# EAGLE design pm25_mainboard_v0.3 (EAGLE 9.6.2)
Assembly variants: DVT, EVT

## Sheet 1 of 3: MCU
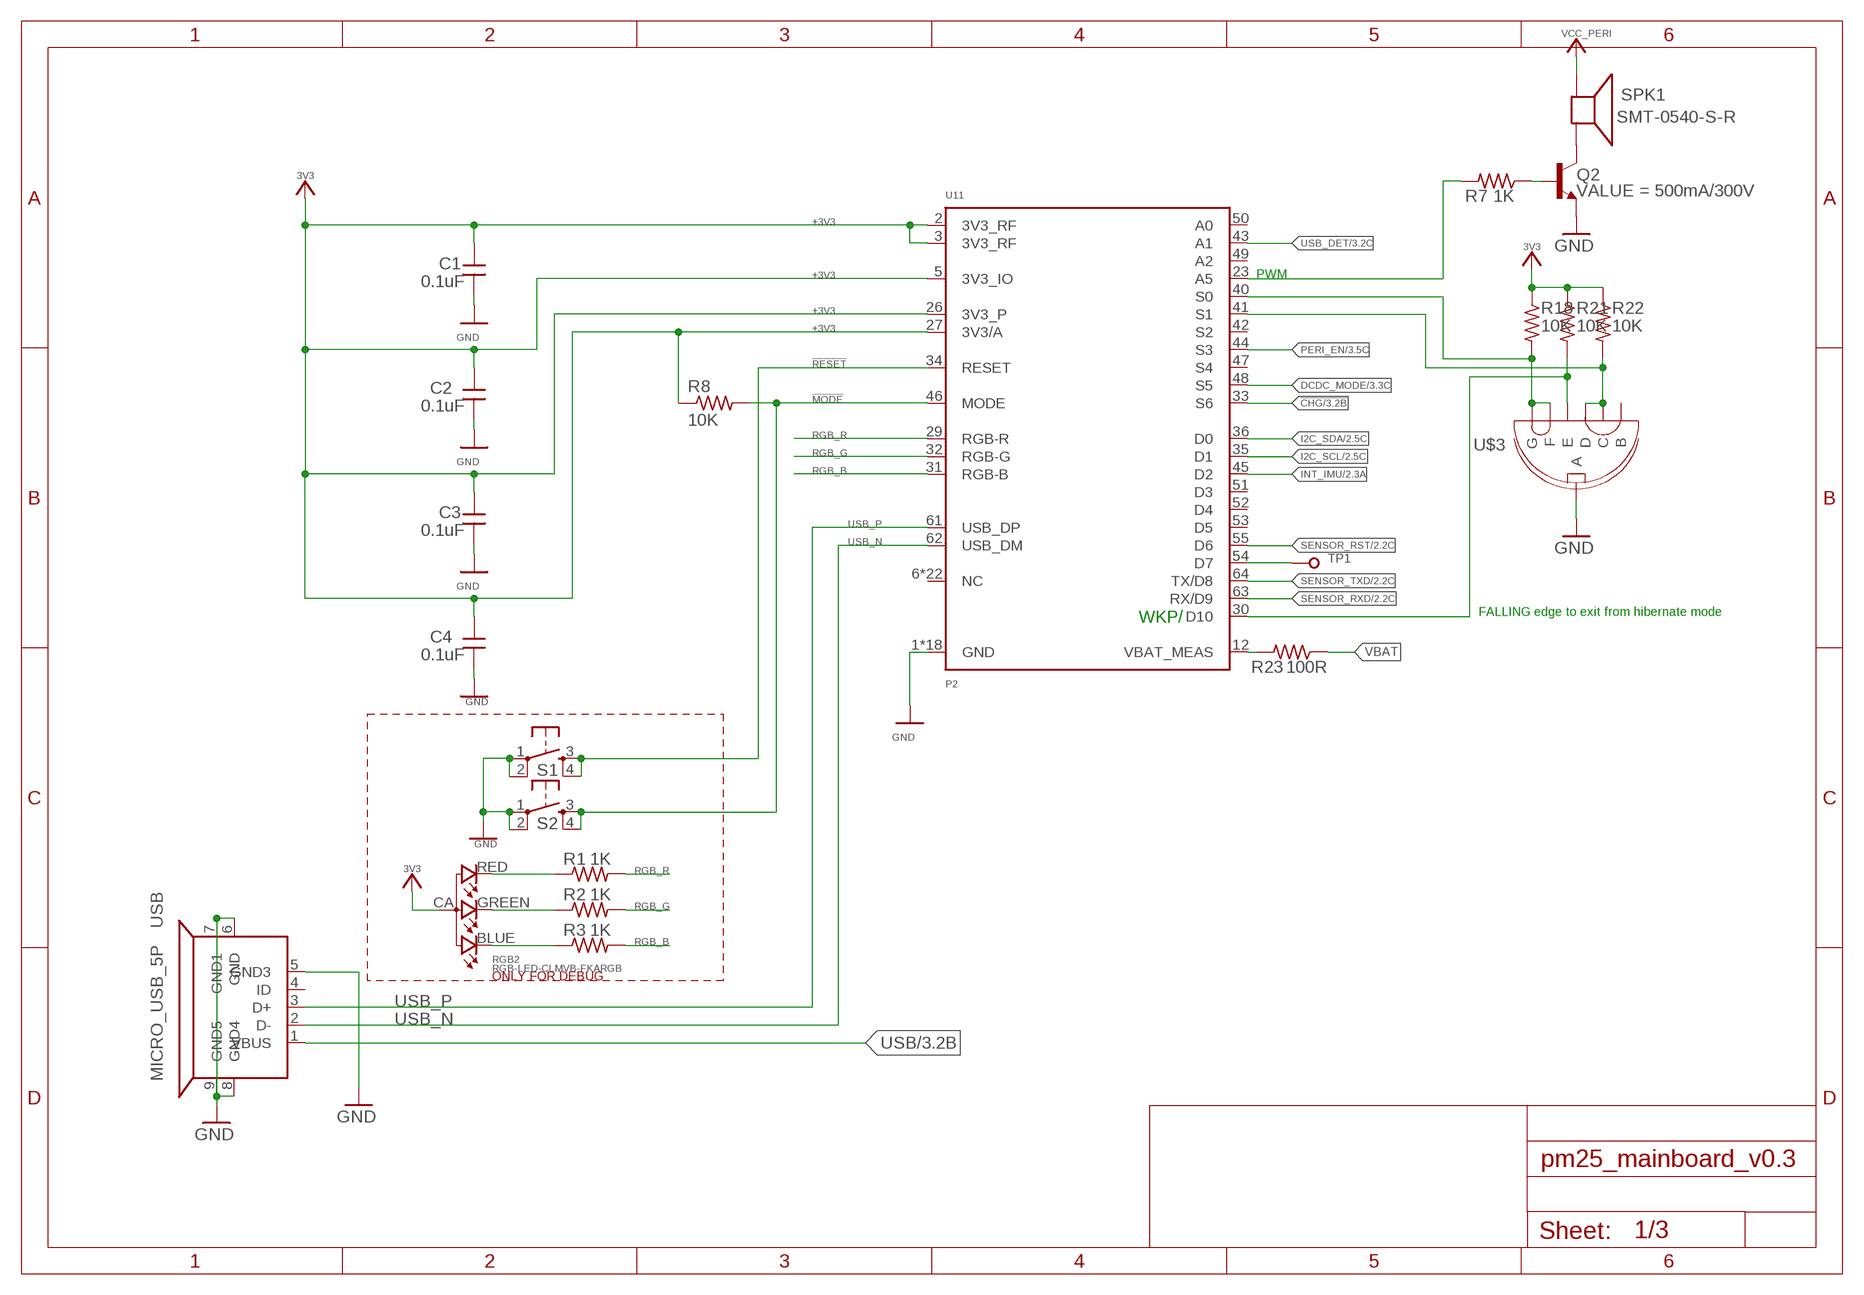
[diagram p0: schematic, sheet 1]

### Parts
C1  0.1uF  CAP_0603  [C0603_P]
C2  0.1uF  CAP_0603  [C0603_P]
C3  0.1uF  CAP_0603  [C0603_P]
C4  0.1uF  CAP_0603  [C0603_P]
Q2  500mA/300V  TRANS_NPN-MMBTA42  [SOT23-3]
R1  1K  RES_0603  [R0603_P]
R2  1K  RES_0603  [R0603_P]
R3  1K  RES_0603  [R0603_P]
R7  1K  RES_1K_0603  [R0603_P]
R8  10K  RES_0603  [R0603_P]
R18  10K  RES_1K_0603  [R0603_P]
R21  10K  RES_1K_0603  [R0603_P]
R22  10K  RES_1K_0603  [R0603_P]
R23  100R  RES_1K_0603  [R0603_P]
RGB2  RGB-LED-CLMVB-FKARGB  [PLCC4-2MM-RGB]
S1  TAC_SWITCHSMD  [TACTILE_SWITCH_SMD]
S2  TAC_SWITCHSMD  [TACTILE_SWITCH_SMD]
SPK1  SMT-0540-S-R  [SMT-0540-S-R]
TP1  TP-1.5MM  [TP]
U11  P2  [P2]
U$3  MULTI_FUN_SWITCH  [MULTI_FUN_SWITCH]
USB  MICRO_USB_5P  MICRO_USBMICRO_USB  [MICRO_USB]

### Nets
!CHG: U11.33(S6) ; also sheet 3
!MODE: R8.2 S2.3 S2.4 U11.46(MODE)
!RESET: S1.3 S1.4 U11.34(RESET)
+3V3: C1.1 C2.1 C3.1 C4.1 R8.1 R18.1 R21.1 R22.1 RGB2.CA U11.2(3V3_RF) U11.3(3V3_RF) U11.5(3V3_IO) U11.26(3V3_P) U11.27(3V3/A) ; supply symbol labelled 3V3 ; also sheet 3
BUZZER: R7.2 U11.23(A5)
DCDC_MODE: U11.48(S5) ; also sheet 3
GND: C1.2 C2.2 C3.2 C4.2 Q2.2(E) S1.1 S1.2 S2.1 S2.2 U11.1(GND) U11.4(GND) U11.13(GND) U11.15(GND) U11.25(GND) U11.28(GND) U11.37(GND) U11.39(GND) U11.59(GND) U11.65(GND) U11.66(GND) U11.67(GND) U11.68(GND) U11.69(GND) U11.70(GND) U11.71(GND) U11.72(GND) U11.73(GND) U$3.A USB.5(GND3) USB.6(GND) USB.7(GND1) USB.8(GND4) USB.9(GND5) ; also sheet 2,3
I2C_SCL: U11.35(D1) ; also sheet 2
I2C_SDA: U11.36(D0) ; also sheet 2
INT_IMU: U11.45(D2) ; also sheet 2
LEFT: R22.2 U11.41(S1) U$3.C U$3.D
MID: R21.2 U11.30(D10) U$3.E
N$9: Q2.3(C) SPK1.-(+)
N$11: R23.2 U11.12(VBAT_MEAS)
N$12: TP1.TP U11.54(D7)
N$17: R1.1 RGB2.RED
N$18: R2.1 RGB2.GREEN
N$19: R3.1 RGB2.BLUE
N$21: Q2.1(B) R7.1
PERI_EN: U11.44(S3) ; also sheet 3
RGB_B: R3.2 U11.31(RGB-B)
RGB_G: R2.2 U11.32(RGB-G)
RGB_R: R1.2 U11.29(RGB-R)
RIGHT: R18.2 U11.40(S0) U$3.F U$3.G
SENSOR_RST: U11.55(D6) ; also sheet 2
SENSOR_RXD: U11.63(RX/D9) ; also sheet 2
SENSOR_TXD: U11.64(TX/D8) ; also sheet 2
USB: USB.1(VBUS) ; also sheet 3
USB_DET: U11.43(A1) ; also sheet 3
USB_N [diff pair]: U11.62(USB_DM) USB.2(D-)
USB_P [diff pair]: U11.61(USB_DP) USB.3(D+)
VBAT: R23.1 ; also sheet 3
VCC_PERI: SPK1.+(-) ; also sheet 2,3
Unconnected: U11.6(NC) U11.7(NC) U11.8(NC) U11.9(NC) U11.10(NC) U11.11(NC) U11.14(NC) U11.16(NC) U11.17(NC) U11.18(NC) U11.19(NC) U11.20(NC) U11.21(NC) U11.22(NC) U11.24(NC) U11.38(NC) U11.42(S2) U11.47(S4) U11.49(A2) U11.50(A0) U11.51(D3) U11.52(D4) U11.53(D5) U11.56(NC) U11.57(NC) U11.58(NC) U11.60(NC) U11.74(NC) U11.75(NC) U$3.B USB.4(ID)

### Notes on the sheet
- PWM
- FALLING edge to exit from hibernate mode
- WKP/
- ONLY FOR DEBUG

## Sheet 2 of 3: SENSORS
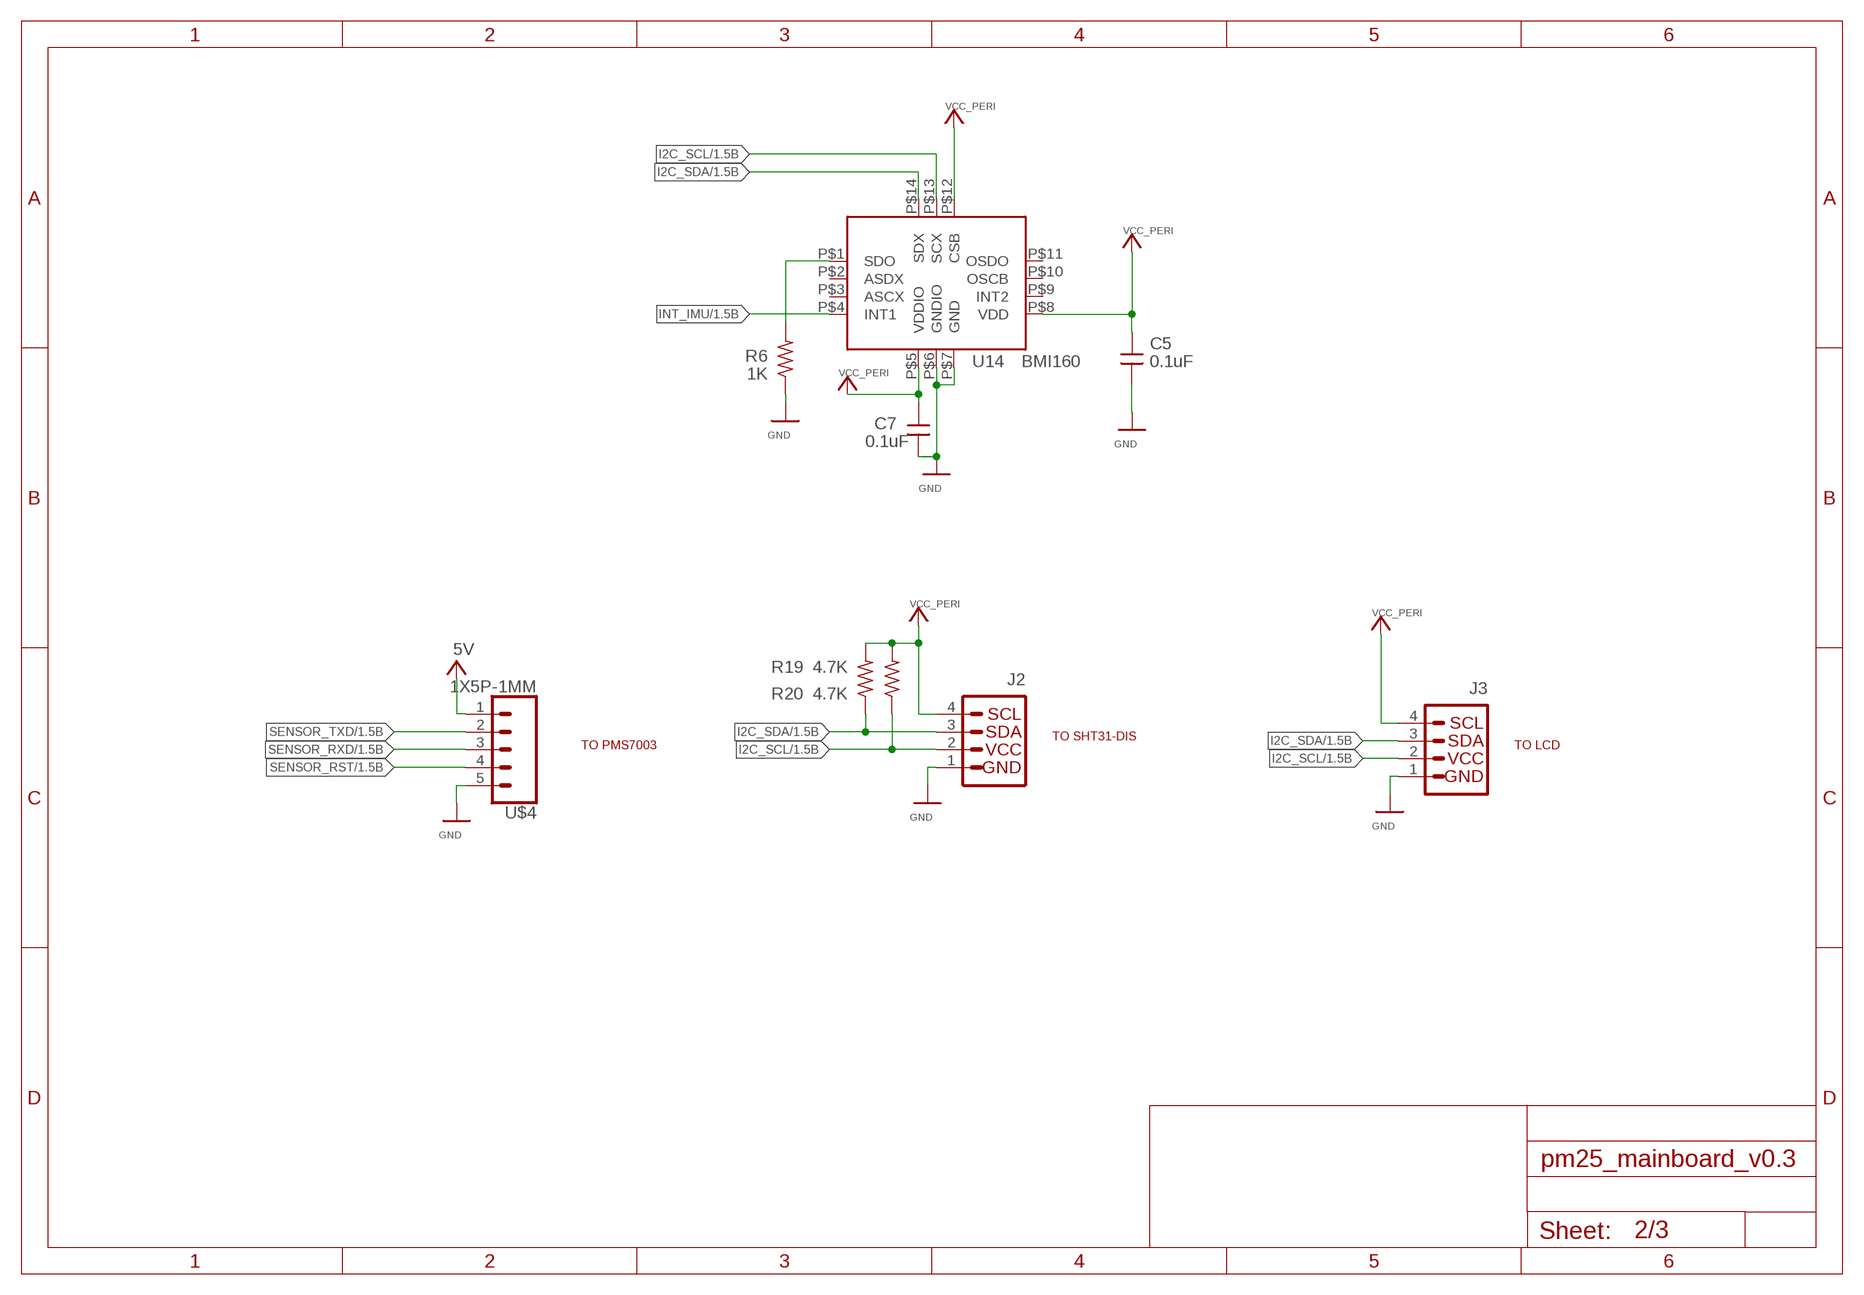
[diagram p1: schematic, sheet 2]

### Parts
C5  0.1uF  CAP_0603  [C0603_P]
C7  0.1uF  CAP_0603  [C0603_P]
J2  QWIIC_CONNECTORJS-1MM  [1X04_1MM_RA]
J3  QWIIC_CONNECTORJS-1MM  [1X04_1MM_RA]
R6  1K  RES_0603  [R0603_P]
R19  4.7K  RES_0603  [R0603_P]
R20  4.7K  RES_0603  [R0603_P]
U14  BMI160  BMI160  [LGA-14L]
U$4  1X5P-1MM  [1X05-1MM]

### Nets
5V: U$4.1 ; also sheet 3
GND: C5.2 C7.2 J2.1(GND) J3.1(GND) R6.1 U14.P$6(GNDIO) U14.P$7(GND) U$4.5 ; also sheet 1,3
I2C_SCL: J2.2(VCC) J3.2(VCC) R20.1 U14.P$13(SCX) ; also sheet 1
I2C_SDA: J2.3(SDA) J3.3(SDA) R19.1 U14.P$14(SDX) ; also sheet 1
INT_IMU: U14.P$4(INT1) ; also sheet 1
N$1: R6.2 U14.P$1(SDO)
SENSOR_RST: U$4.4 ; also sheet 1
SENSOR_RXD: U$4.3 ; also sheet 1
SENSOR_TXD: U$4.2 ; also sheet 1
VCC_PERI: C5.1 C7.1 J2.4(SCL) J3.4(SCL) R19.2 R20.2 U14.P$5(VDDIO) U14.P$8(VDD) U14.P$12(CSB) ; also sheet 1,3
Unconnected: U14.P$2(ASDX) U14.P$3(ASCX) U14.P$9(INT2) U14.P$10(OSCB) U14.P$11(OSDO)

### Notes on the sheet
- TO SHT31-DIS
- TO PMS7003 | TO LCD

## Sheet 3 of 3: POEWR
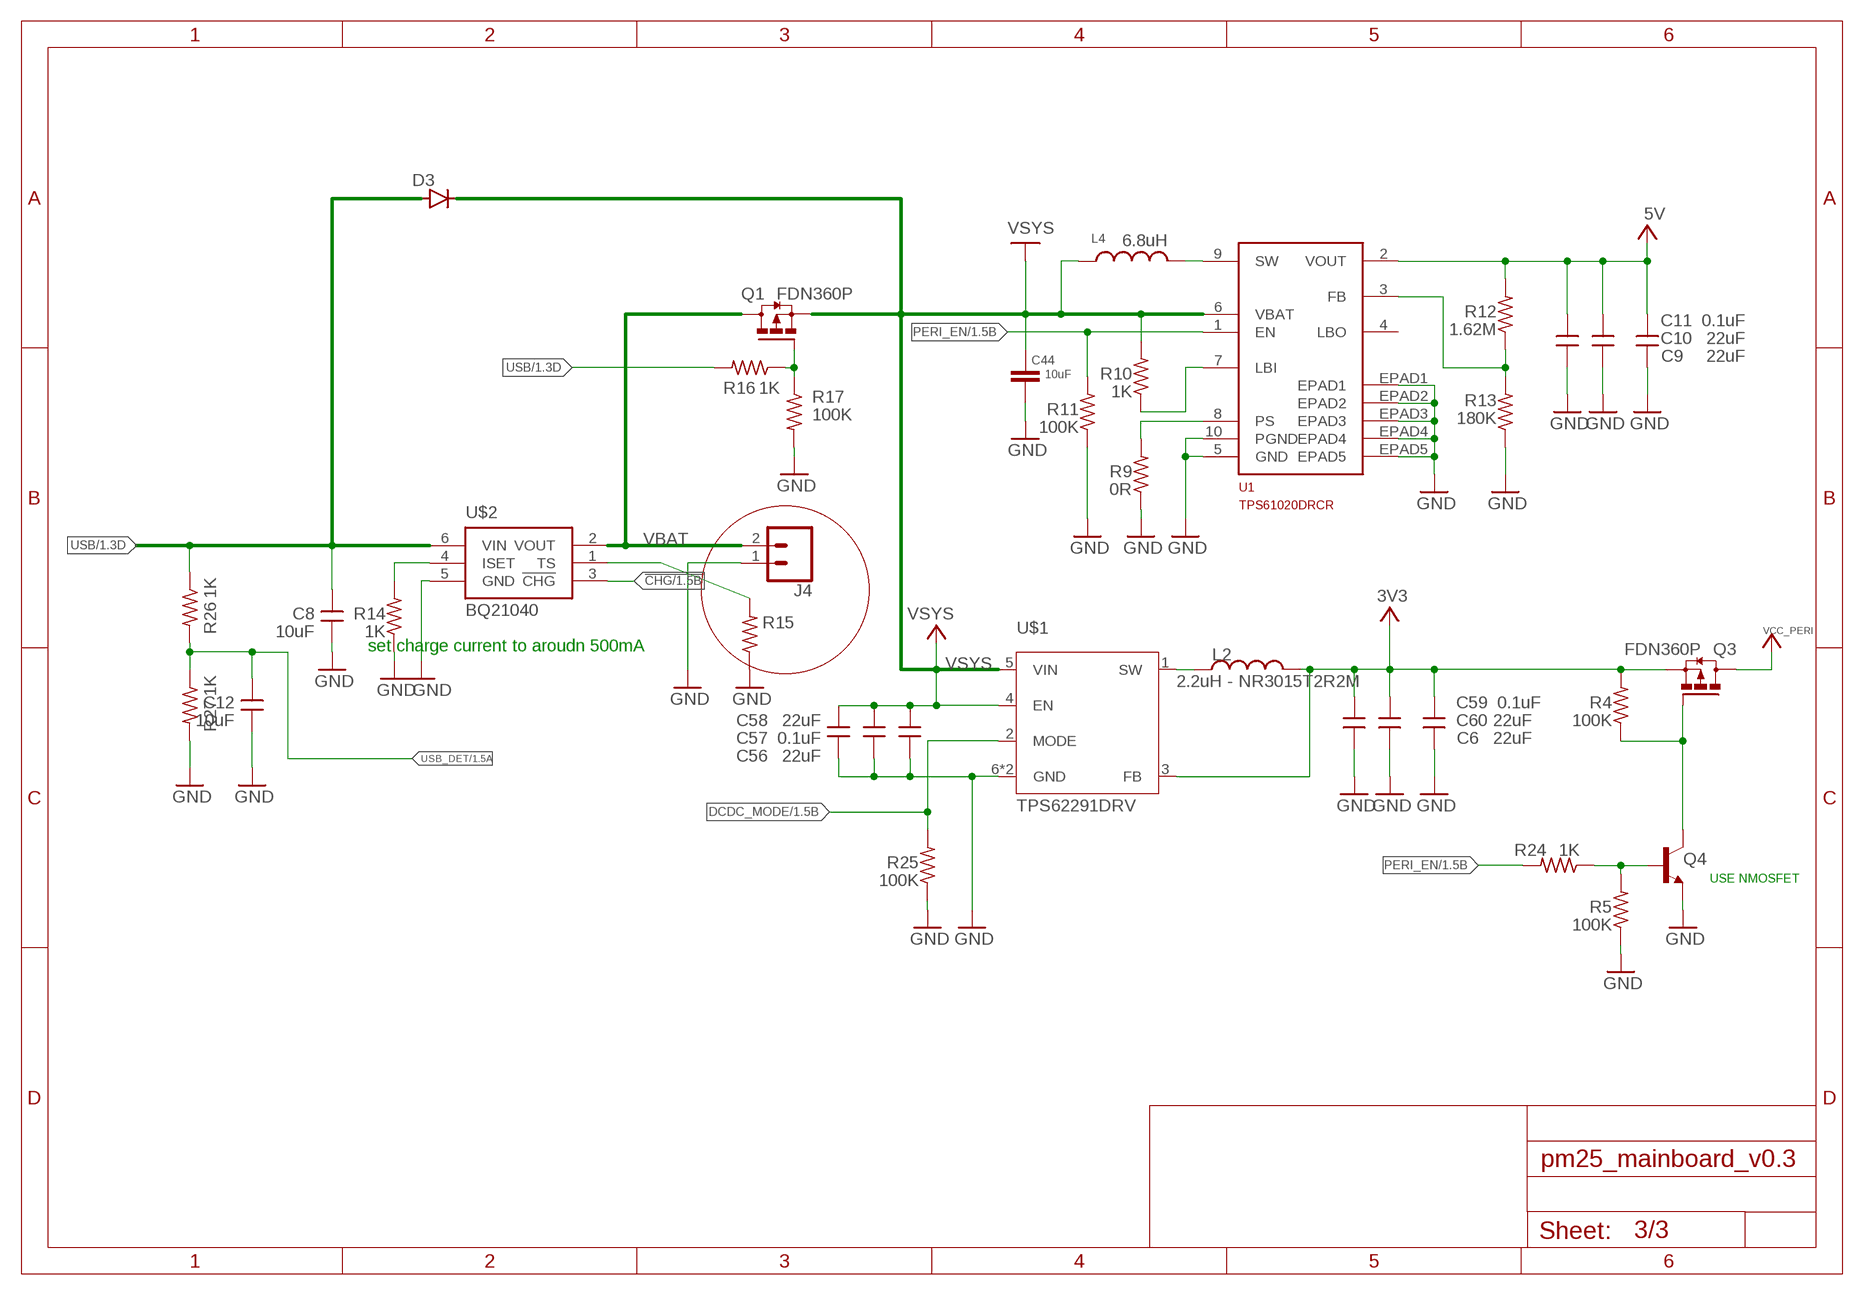
[diagram p2: schematic, sheet 3]

### Parts
C6  22uF  CAP_0603  [C0603_P]
C8  10uF  CAP_0603  [C0603_P]
C9  0.1uF  CAP_0603  [C0603_P]
C10  22uF  CAP_0603  [C0603_P]
C11  22uF  CAP_0603  [C0603_P]
C12  10uF  CAP_0603  [C0603_P]
C44  10uF  GRM21BR61C106KE15K  [C0805_MURATA_GRM21]
C56  22uF  CAP_0603  [C0603_P]
C57  0.1uF  CAP_0603  [C0603_P]
C58  22uF  CAP_0603  [C0603_P]
C59  0.1uF  CAP_0603  [C0603_P]
C60  22uF  CAP_0603  [C0603_P]
D3  DIODE-SOD123  [SOD123]
J4  CONN_02-JST-2MM-SMT  [JST-2-SMD]
L2  2.2uH - NR3015T2R2M  INDUCTOR-SPARKFUNNR3015T4R7M  [INDUCTOR-NR3015]
L4  6.8uH  CDRH5D28NP-6R2NC  [CDRH5D28NP-6R2NC]
Q1  FDN360P  [SUPER-SOT3]
Q3  FDN360P  [SUPER-SOT3]
Q4  TRANS_NPN-MMBTA42  [SOT23-3]
R4  100K  RES_0603  [R0603_P]
R5  100K  RES_0603  [R0603_P]
R9  0R  RES_0603  [R0603_P]
R10  1K  RES_0603  [R0603_P]
R11  100K  RES_0603  [R0603_P]
R12  1.62M  RES_0603  [R0603_P]
R13  180K  RES_0603  [R0603_P]
R14  1K  RES_0603  [R0603_P]
R15  RES_0603  [R0603_P]
R16  1K  RES_0603  [R0603_P]
R17  100K  RES_0603  [R0603_P]
R24  1K  RES_0603  [R0603_P]
R25  100K  RES_0603  [R0603_P]
R26  1K  RES_0603  [R0603_P]
R27  1K  RES_0603  [R0603_P]
U1  TPS61020DRCR  [TPS61020DRCR]
U$1  TPS62291DRV  [S-PWSON-N6]
U$2  BQ21040  [SOT23-6]

### Nets
3V8_SW: L4.P$2 U1.9(SW)
5V: C9.2 C10.2 C11.2 R12.2 U1.2(VOUT) ; also sheet 2
!CHG: U$2.3(!CHG) ; also sheet 1
+3V3: C6.2 C59.2 C60.2 L2.2 Q3.2(S) R4.2 U$1.3(FB) ; supply symbol labelled 3V3 ; also sheet 1
DCDC_MODE: R25.2 U$1.2(MODE) ; also sheet 1
GND: C6.1 C8.1 C9.1 C10.1 C11.1 C12.1 C44.2 C56.1 C57.1 C58.1 C59.1 C60.1 J4.1 Q4.2(E) R5.1 R9.1 R11.1 R13.1 R14.1 R15.1 R17.2 R25.1 R27.2 U1.5(GND) U1.10(PGND) U1.EPAD1 U1.EPAD2 U1.EPAD3 U1.EPAD4 U1.EPAD5 U$1.6(GND) U$1.TP(GND) U$2.5(GND) ; also sheet 1,2
N$2: R9.2 U1.8(PS)
N$3: R10.1 U1.7(LBI)
N$4: R14.2 U$2.4(ISET)
N$5: R12.1 R13.2 U1.3(FB)
N$6: Q3.1(G) Q4.3(C) R4.1
N$7: R15.2 U$2.1(TS)
N$8: Q1.1(G) R16.1 R17.1
N$10: Q4.1(B) R5.2 R24.1
N$52: L2.1 U$1.1(SW)
PERI_EN: R11.2 R24.2 U1.1(EN) ; also sheet 1
USB: C8.2 D3.A R16.2 R26.1 U$2.6(VIN) ; also sheet 1
USB_DET: C12.2 R26.2 R27.1 ; also sheet 1
VBAT: J4.2 Q1.3(D) U$2.2(VOUT) ; also sheet 1
VCC_PERI: Q3.3(D) ; also sheet 1,2
VSYS: C44.1 C56.2 C57.2 C58.2 D3.C L4.P$1 Q1.2(S) R10.2 U1.6(VBAT) U$1.4(EN) U$1.5(VIN)
Unconnected: U1.4(LBO)

### Notes on the sheet
- set charge current to aroudn 500mA
- USE NMOSFET

## Library data of the parts
C1-C12 C56-C60 = particle-studios:CAP_
C44 = CAPACITOR:GRM21BR61C106KE15K; PACKAGE: 0805; RATING: 16V; TOLERANCE: 10%
D3 = diode:DIODE-: DIODE
J2 J3 = SparkFun-Connectors:QWIIC_CONNECTOR: SparkFun I2C Standard Qwiic Connector An SMD 1mm pitch JST connector makes it easy and quick (get it? Qwiic?) to connect I2C devices to each other. The Qwiic system <http://www.sparkfun.com/qwiic> enables fast and solderless connection between popular platforms and various sensors and actuators. We carry 200mm <https://www.sparkfun.com/products/14204>, 100mm <https://www.sparkfun.com/products/14205>, 50mm <https://www.sparkfun.com/products/14206>, and breadboard friendly <https://www.sparkfun.com/products/14207> Qwiic cables. We also offer 10 pcs strips <https://www.sparkfun.com/products/14323> the SMD connectors.
J4 = SparkFun-Connectors:CONN_02: Multi connection point. Often used as Generic Header-pin footprint for 0.1 inch spaced/style header connections On any of the 0.1 inch spaced packages, you can populate with these: Break Away Headers - Straight <https://www.sparkfun.com/products/116> (PRT-00116) Break Away Male Headers - Right Angle <https://www.sparkfun.com/products/553> (PRT-00553) Female Headers <https://www.sparkfun.com/products/115> (PRT-00115) Break Away Headers - Machine Pin <https://www.sparkfun.com/products/117> (PRT-00117) Break Away Female Headers - Swiss Machine Pin <https://www.sparkfun.com/products/743> (PRT-00743) For SCREWTERMINALS and SPRING TERMINALS visit here: Screw Terimnals on SparkFun.com <https://www.sparkfun.com/search/results?term=Screw+Terminals> (5mm/3.5mm/2.54mm spacing) This device is also useful as a general connection point to wire up your design to another part of your project. Our various solder wires solder well into these plated through hole pads. Hook-Up Wire - Assortment (Stranded, 22 AWG) <https://www.sparkfun.com/products/11375> (PRT-11375) Hook-Up Wire - Assortment (Solid Core, 22 AWG) <https://www.sparkfun.com/products/11367> (PRT-11367) View the entire wire category on our website here <https://www.sparkfun.com/categories/141> Special notes: Molex polarized connector foot print use with: PRT-08233 with associated crimp pins and housings. 2.54_SCREWTERM for use with PRT-10571. 3.5mm Screw Terminal footprints for PRT-08084 5mm Screw Terminal footprints for use with PRT-08432; PROD_ID: CONN-11443
L2 = Particle:INDUCTOR-SPARKFUN: Inductors Basic Inductor/Choke - 0603 and 1206. Footprints are not proven and vary greatly between part numbers. SRN6045- 33uH, 20% 1.4A; DESP: FIXED IND 2.2UH 1.5A 72 MOHM SMD; MFG: TAIYO; MPN: NR3015T2R2M; NR3015T4R7M: 4.7uH; PPN: PT-200013
L4 = Particle_AT_Power:CDRH5D28NP-6R2NC; PACKAGE: 5757; RATING: 1.8A; TOLERANCE: 30%; VALUE: 6.2µH
Q1 Q3 = transistor-power:FDN360P: Single P-Channel, PowerTrench (R) MOSFET Source: http://www.fairchildsemi.com/ds/FD/FDN360P.pdf
Q2 = SparkFun-DiscreteSemi:TRANS_NPN: NPN transistor Current controlled devices typically used to amplify current or used as a switch. BC547 - COM-08928 <http://www.sparkfun.com/products/8928> (TO-92 45V 100mA) (1.Collector 2.Base 3.Emitter) 2N3904 - COM-00521 <http://www.sparkfun.com/products/521> (TO-92 40V 200mA) (1.Emitter 2.Base 3.Collector) P2N2222A - COM-12852 <http://www.sparkfun.com/products/12852> (TO-92 40V 600mA) (1.Collector 2.Base 3.Emitter); DESP: TRANS NPN 300V 0.5A SOT23-3; MFG: DIODES INC; MPN: MMBTA42-7-F; PPN: PT-200313; PROD_ID: TRANS-09116
Q4 = SparkFun-DiscreteSemi:TRANS_NPN: NPN transistor Current controlled devices typically used to amplify current or used as a switch. BC547 - COM-08928 <http://www.sparkfun.com/products/8928> (TO-92 45V 100mA) (1.Collector 2.Base 3.Emitter) 2N3904 - COM-00521 <http://www.sparkfun.com/products/521> (TO-92 40V 200mA) (1.Emitter 2.Base 3.Collector) P2N2222A - COM-12852 <http://www.sparkfun.com/products/12852> (TO-92 40V 600mA) (1.Collector 2.Base 3.Emitter); DESP: TRANS NPN 300V 0.5A SOT23-3; MFG: DIODES INC; MPN: MMBTA42-7-F; PPN: PT-200313; PROD_ID: TRANS-09116; VALUE: 500mA/300V
R1-R6 R8-R17 R19 R20 R24-R27 = particle-studios:RES_: Particle Resistors
R7 = particle-studios:RES_: Particle Resistors; DESP: RES SMD 1K OHM 1% 1/16W 0603; MFG: FENGHUA; MPN: RC-03K102FT; PPN: PT-200135
R18 R21-R23 = particle-studios:RES_: Particle Resistors; DESP: RES SMD 1K OHM 1% 1/16W 0603; MFG: FENGHUA; MPN: RC-03K102FT; PPN: PT-200135; VALUE: 1K
RGB2 = Particle:RGB-LED-CLMVB-FKA: CREE CLMVB-FKA RGB LED 2mm x 2mm
S1 S2 = Particle:TAC_SWITCH: SMD Tactiile Switch
SPK1 = adafruit:SMT-0540-S-R: SMT-0549-S-R Small surface-mount magnetic buzzer; DESP: AUDIO MAGNETIC XDCR 2-4V SMD; MFG: PUI Audio; MPN: SMT-0540-S-R; PPN: 190-00001
TP1 = particle-studios:TP
U1 = particle-studios:TPS61020DRCR
U11 = particle-studios:P2: Particle P2
U14 = particle SZ:BMI160
U$1 = particle-studios:TPS62291
U$2 = particle-studios:BQ21040
U$3 = particle-studios:MULTI_FUN_SWITCH
U$4 = particle-studios:1X5P-1MM
USB = RedBear:MICRO_USB: Micro-USB

## Net classes
0 default: clearance 0.152 mm
1 diff pair: width 0.152 mm, drill 0.3 mm, clearance 0.152 mm
2 120R_Impedance: width 0.152 mm
3 BAT: clearance 0.203 mm
6 +3V3: clearance 0.152 mm

## Board
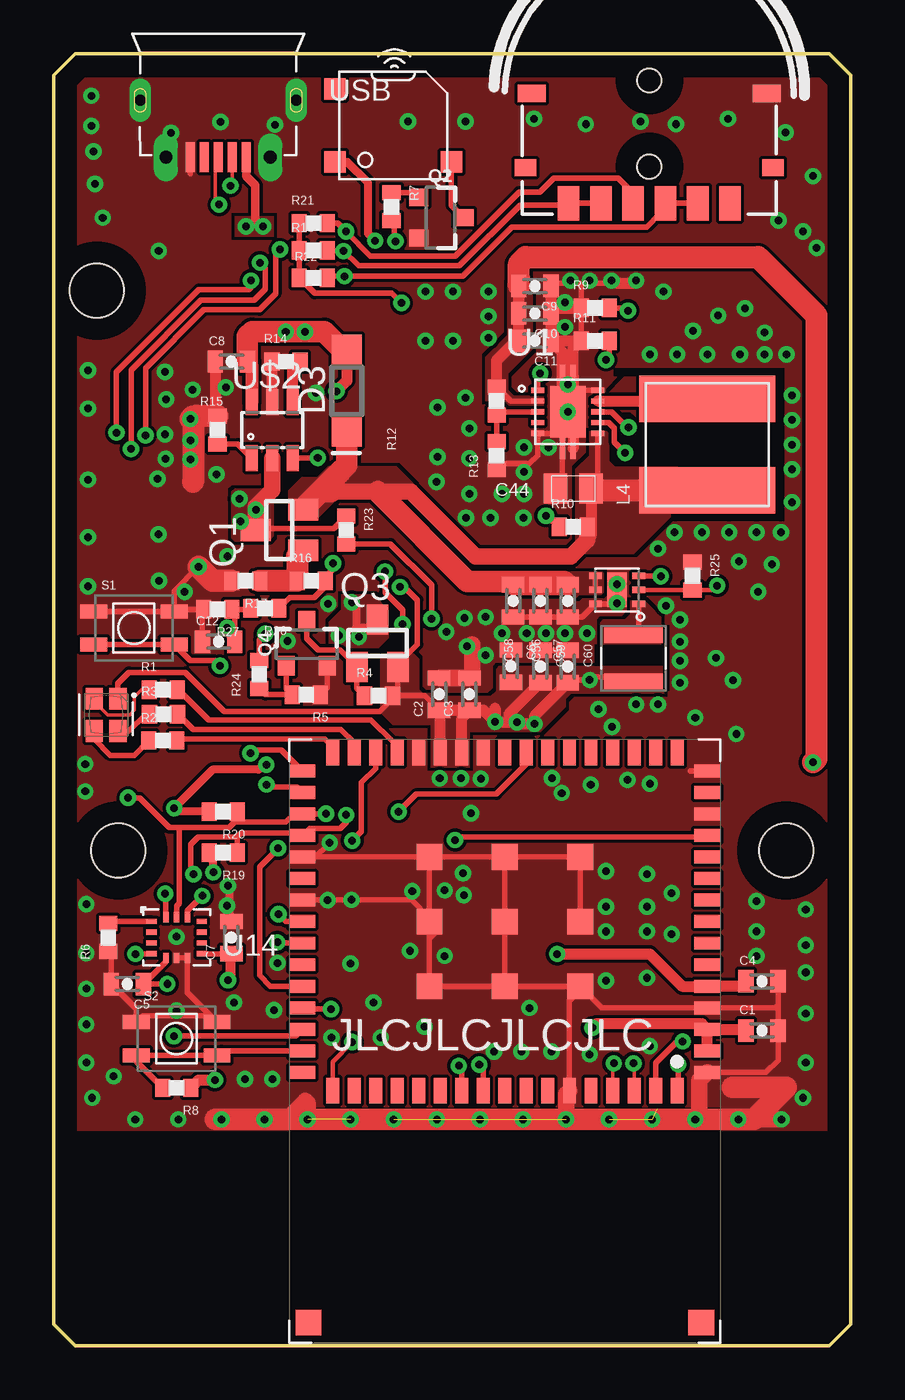
[diagram p3: board, top side]
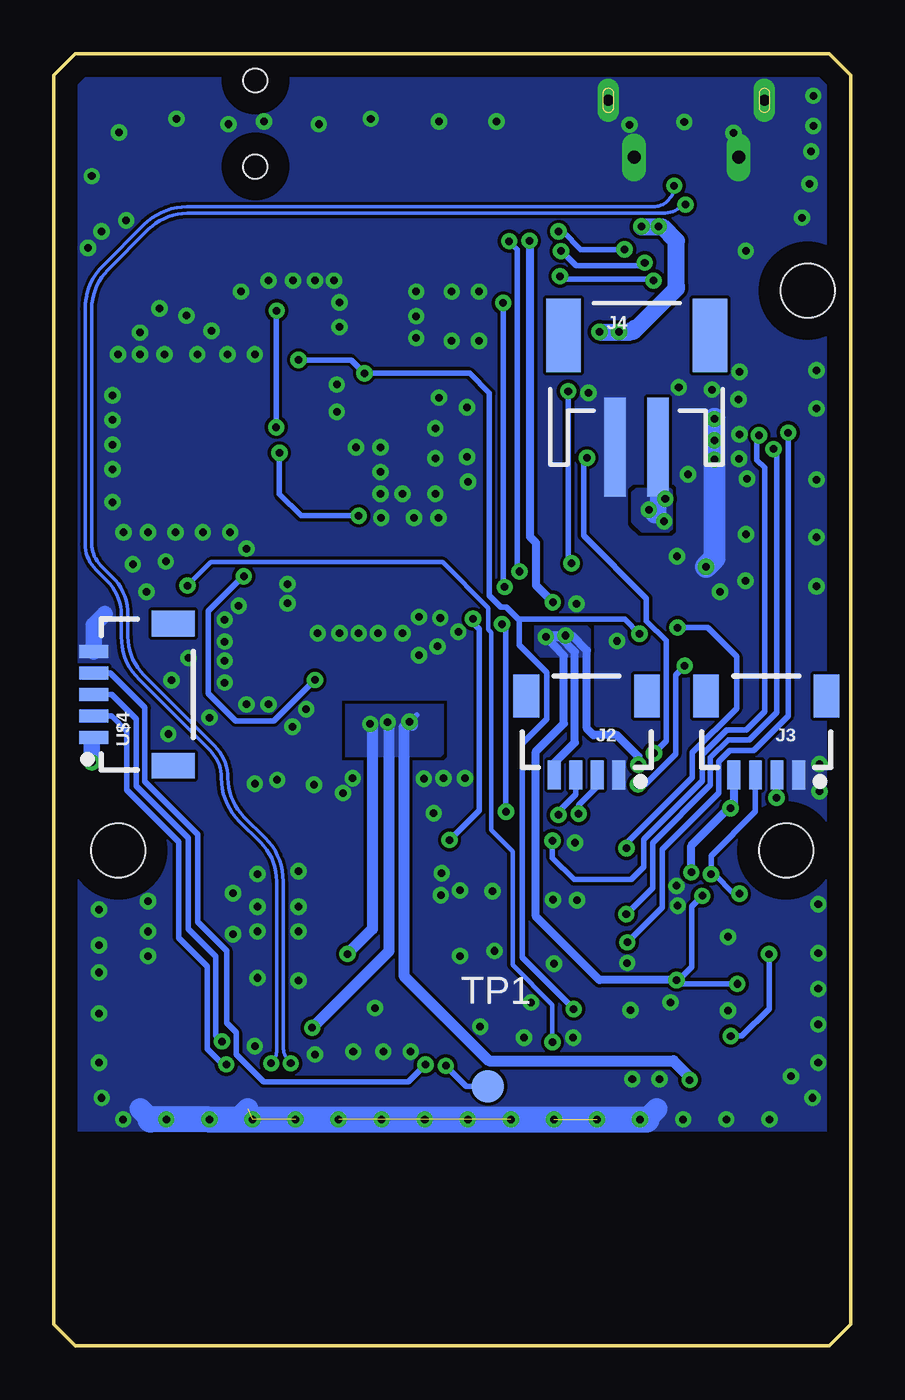
[diagram p4: board, bottom side, seen from below]

Size 37 x 60 mm. Coordinates in mm from the lower left corner, seen from the top.
Outline: 0,59 1,60 36,60 37,59 37,1 36,0 1,0 0,1 0,59
Copper layers (1*16): Top 0.035mm / dielectric 1.5mm / Bottom 0.035mm
Design rules "default *": minimum track width 6mil, minimum drill 0.35mm, track to track 6mil, track to pad 6mil, pad to pad 6mil, via to via 6mil, smd to smd 6mil, copper to edge 40mil, drill to drill 6mil, minimum pad ring 10mil, minimum via ring 8mil, stop-mask expansion 4mil, vias tented up to drill 3.6mm, thermal gap 10mil
Holes 2.5 mm at 3,23 34,23 2,49

### Footprints (pad centres in the part's own frame; a part is rotated, then mirrored left to right if it is on the bottom)
C0603_P = smd 0.711 x 1.041: 1 -0.749,0; 2 0.749,0
C0805_MURATA_GRM21 = smd 1.1 x 1.4: 1 -0.825,0; 2 0.825,0
SOD123 = smd 1.4 x 1.4: A 1.9,0; C -1.9,0
1X04_1MM_RA = smd 0.6 x 1.35: 1 -1.5,0; 2 -0.5,0; 3 0.5,0; 4 1.5,0 | smd 1.2 x 2: NC1 2.8,-3.675; NC2 -2.8,-3.675
JST-2-SMD = smd 1 x 4.6: 1 -1,-3.7; 2 1,-3.7 | smd 1.6 x 3.4: NC1 -3.4,1.5; NC2 3.4,1.5
INDUCTOR-NR3015 = smd 0.8 x 2.7: 1 -1.1,0; 2 1.1,0
CDRH5D28NP-6R2NC = smd 2.15 x 6.3: P$1 -2.125,0; P$2 2.125,0
SUPER-SOT3 = smd 1 x 1.4: 1 -0.95,-1.1; 2 0.95,-1.1; 3 0,1.1
SOT23-3 = smd 0.8 x 0.9: 1 -0.95,-1; 2 0.95,-1; 3 0,1.1
R0603_P = smd 0.7 x 0.85: 1 -0.65,0; 2 0.65,0
PLCC4-2MM-RGB = smd 1 x 0.8: BLUE -0.75,-0.55; CA 0.75,-0.55; GREEN -0.75,0.55; RED 0.75,0.55
TACTILE_SWITCH_SMD = smd 1.25 x 0.65: 1 -1.875,0.775; 2 1.875,0.775; 3 -1.875,-0.775; 4 1.875,-0.775
SMT-0540-S-R = smd 1 x 1: + 1.7,-2.7; - 1.7,2.7; M -1.7,-2.7
TP = smd 1.5 x 1.5: TP 0,0
TPS61020DRCR = smd 0.6 x 0.24: 1 -1.4,1; 2 -1.4,0.5; 3 -1.4,0; 4 -1.4,-0.5; 5 -1.4,-1; 6 1.4,-1; 7 1.4,-0.5; 8 1.4,0; 9 1.4,0.5; 10 1.4,1 | smd 1.65 x 2.4: EPAD1 0,0 | smd 0.25 x 1: EPAD2 -0.25,-1.7; EPAD3 0.25,-1.7; EPAD4 -0.25,1.7; EPAD5 0.25,1.7
P2 = smd 1.2 x 0.6: 1 -9.4,2.45; 2 -9.4,1.45; 3 -9.4,0.45; 4 -9.4,-0.55; 5 -9.4,-1.55; 6 -9.4,-2.55; 7 -9.4,-3.55; 8 -9.4,-4.55; 9 -9.4,-5.55; 10 -9.4,-6.55; 11 -9.4,-7.55; 12 -9.4,-8.55; 13 -9.4,-9.55; 14 -9.4,-10.55; 15 -9.4,-11.55; 33 9.4,-11.55; 34 9.4,-10.55; 35 9.4,-9.55; 36 9.4,-8.55; 37 9.4,-7.55; 38 9.4,-6.55; 39 9.4,-5.55; 40 9.4,-4.55; 41 9.4,-3.55; 42 9.4,-2.55; 43 9.4,-1.55; 44 9.4,-0.55; 45 9.4,0.45; 46 9.4,1.45; 47 9.4,2.45 | smd 0.6 x 1.2: 16 -8,-12.4; 17 -7,-12.4; 18 -6,-12.4; 19 -5,-12.4; 20 -4,-12.4; 21 -3,-12.4; 22 -2,-12.4; 23 -1,-12.4; 24 0,-12.4; 25 1,-12.4; 26 2,-12.4; 27 3,-12.4; 28 4,-12.4; 29 5,-12.4; 30 6,-12.4; 31 7,-12.4; 32 8,-12.4; 48 8,3.3; 49 7,3.3; 50 6,3.3; 51 5,3.3; 52 4,3.3; 53 3,3.3; 54 2,3.3; 55 1,3.3; 56 0,3.3; 57 -1,3.3; 58 -2,3.3; 59 -3,3.3; 60 -4,3.3; 61 -5,3.3; 62 -6,3.3; 63 -7,3.3; 64 -8,3.3 | smd 1.2 x 1.2: 65 -3.5,-1.55; 66 -3.5,-4.55; 67 -3.5,-7.55; 68 0,-1.55; 69 0,-4.55; 70 0,-7.55; 71 3.5,-1.55; 72 3.5,-4.55; 73 3.5,-7.55; 74 9.12,14.07; 75 -9.12,14.07
LGA-14L = smd 0.475 x 0.25: P$1 -1.165,0.75; P$2 -1.165,0.25; P$3 -1.165,-0.25; P$4 -1.165,-0.75; P$8 1.165,-0.75; P$9 1.165,-0.25; P$10 1.165,0.25; P$11 1.165,0.75 | smd 0.25 x 0.475: P$5 -0.5,-0.95; P$6 0,-0.95; P$7 0.5,-0.95; P$12 0.5,0.95; P$13 0,0.95; P$14 -0.5,0.95
S-PWSON-N6 = smd 0.3 x 0.6: 1 -0.65,-1; 2 0,-1; 3 0.65,-1; 4 0.65,1; 5 0,1; 6 -0.65,1 | smd 1.6 x 0.9: TP 0,0
SOT23-6 = smd 0.55 x 1.2: 1 -0.95,-1.3; 2 0,-1.3; 3 0.95,-1.3; 4 0.95,1.3; 5 0,1.3; 6 -0.95,1.3
MULTI_FUN_SWITCH = smd 1.3 x 0.8: A 5.45,5.1; S@3 -5.45,5.1 | smd 1 x 1.6: B 3.75,0; C 2.25,0; D 0.75,0; E -0.75,0; F -2.25,0; G -3.75,0 | smd 1 x 0.8: S@1 -5.75,1.65; S@2 5.75,1.65 | hole 1.1: 0,1.7; 0,5.7
1X05-1MM = smd 0.6 x 1.35: 1 -2,0; 2 -1,0; 3 0,0; 4 1,0; 5 2,0 | smd 1.2 x 2: NC1 3.3,-3.675; NC2 -3.3,-3.675
MICRO_USB = smd 0.4 x 1.4: 1 1.3,0.1; 2 0.65,0.1; 3 0,0.1; 4 -0.65,0.1; 5 -1.3,0.1 | drill 0.6 pad 0.75 long: 6 2.425,0.1 | drill 0.5 pad 1 long: 7 3.625,2.75; 8 -3.625,2.75 | drill 0.6 pad 0.65 long: 9 -2.425,0.1

### Placement (x,y rotation side)
C1  32.88,14.64 0 top
C2  17.89,30.26 90 top
C3  19.29,30.26 90 top
C4  32.88,16.92 0 top
C5  3.41,16.8 180 top
C6  21.22,31.56 270 top
C7  8.24,18.95 90 top
C8  8.24,45.7 0 top
C9  22.34,49.21 180 top
C10  22.34,47.94 180 top
C11  22.34,46.67 180 top
C12  7.65,32.7 0 top
C44  24.11,39.81 180 top
C56  22.59,34.59 90 top
C57  23.86,34.59 90 top
C58  21.32,34.59 90 top
C59  22.59,31.54 270 top
C60  23.86,31.54 270 top
D3  13.6,44.35 90 top
J2  12.26,26.51 180 bottom
J3  3.92,26.51 180 bottom
J4  9.94,45.43 0 bottom
L2  26.91,31.92 270 top
L4  30.34,41.85 90 top
Q1  10.48,37.88 90 top
Q2  17.94,52.39 270 top
Q3  15.02,32.63 0 top
Q4  11.75,32.58 0 top
R1  5.07,30.47 0 top
R2  5.06,28.11 0 top
R3  5.09,29.32 0 top
R4  15.07,30.19 0 top
R5  11.72,30.24 180 top
R6  2.53,18.95 90 top
R7  15.68,52.89 270 top
R8  5.7,11.97 180 top
R9  25.13,48.2 0 top
R10  24.11,38.04 0 top
R11  25.13,46.67 0 top
R12  20.56,43.88 90 top
R13  20.56,41.34 90 top
R14  10.78,45.7 0 top
R15  7.61,42.53 270 top
R16  11.95,35.52 0 top
R17  8.9,35.52 180 top
R18  12.05,50.86 0 top
R19  7.86,22.89 180 top
R20  7.86,24.8 180 top
R21  12.05,52.13 0 top
R22  12.05,49.59 0 top
R23  13.57,37.88 270 top
R24  9.54,31.18 90 top
R25  29.65,35.75 270 top
R26  9.8,34.25 180 top
R27  7.6,34.2 180 top
RGB2  2.42,29.3 90 top
S1  3.72,33.33 0 top
S2  5.7,14.26 0 top
SPK1  15.76,56.68 270 top
TP1  16.85,12.05 0 bottom
U1  23.86,43.37 0 top
U11  20.94,15.14 180 top
U14  5.7,18.95 0 top
U$1  26.15,35.1 90 top
U$2  10.14,42.53 0 top
U$3  27.65,53.06 0 top
U$4  35.14,30.24 90 bottom
USB  7.63,55.09 0 top

### Tracks (layer width: path | path; a pad name or v marks a point on that pad's centre or on a via)
3V8
  pour Top (no thermals): 25.64,44.13 26.53,45.02 27.92,45.02 27.92,43.5 27.54,43.12 27.04,43.12 26.78,43.37 26.4,43.37 26.02,43.75 25.77,43.75 25.64,43.88
3V8_SW
  Top 0.152: L4.P$2 27.64,43.97 arc45 27.42,43.88
  Top 0.508: U1.9 27.42,43.88
5V  (via drill 0.35)
  Top 0.254: U1.2 21.22,43.87 R12.2 20.56,45.64 C11.2 21.59,46.8 21.59,47.82
  Top 0.508: R12.2 20.56,45.77 21.59,46.8 | C11.2 21.59,47.82 C9.2 | C10.2 21.59,49.59
  Top 1.016: C9.2 21.59,49.59 21.59,50.24 21.91,50.56 32.7,50.56 35.4,47.86 35.4,27.25 v35.24,27.09
  Bottom 0.254: U$4.1 35.24,28.14
  Bottom 0.762: 35.24,28.14 v35.24,27.09
  pour Top (no thermals): 21.32,44.13 22.72,44.13 22.72,43.62 21.19,43.62 20.94,43.88 20.05,43.88 20.05,45.91 21.07,46.93 21.07,49.34 22.21,49.34 22.21,46.29 21.07,45.15 21.07,44.39
!CHG  (via drill 0.35)
  Top 0.254: U$2.3 12.27,41.23 v12.25,41.23 | U11.33 10.56,27.67 9.28,27.67 v9.13,27.52
  Bottom 0.254: v9.13,27.52 8.57,28.08 8.57,32.74 9.49,33.66 9.49,34.71 12.41,37.63 12.41,41.08 v12.25,41.23
!MODE
  Top 0.254: R8.2 3.82,13.2 S2.3 S2.4 7.79,13.7 U11.46
!RESET  (via drill 0.35)
  Top 0.254: v9.88,26.06 9.99,25.95 11.29,25.95 U11.34 | v7.71,31.57 7.46,31.82 6.33,31.82 S1.4 S1.3
  Bottom 0.254: v9.88,26.06 9.88,26.04 9.57,26.04 8.14,27.47 8.14,31.15 v7.71,31.57
+3V3  (via drill 0.35)
  Top 0.254: C60.2 23.99,30.92 v24.88,30.92 25,31.05 26.69,31.05 L2.2 | U$1.3 28.04,35.75 28.05,35.73 v28.18,35.73 | C2.1 17.21,30.19 15.86,30.19 | 15.86,30.19 R4.2 15.97,30.44 Q3.2 15.97,31.67 16.88,32.58 16.88,34.63 16.27,35.24 v16.07,35.24 | v16.14,48.43 15.68,48.88 12.11,48.88 R22.1 R18.1 R21.1 | RGB2.CA 2.97,30.76 3.48,31.27 6.11,31.27 7.91,29.47 15.14,29.47 15.86,30.19
  Top 0.508: v20.49,28.97 19.95,29.51 C3.1 | C3.1 18.15,29.51 | 18.15,29.51 C2.1 | U11.27 17.94,29.3 18.15,29.51 | U11.26 18.94,29.16 C3.1 | C59.2 21.12,29.33 v21.5,28.95 | U11.3 30.09,14.95 25.19,14.95 v25,14.76 | U11.2 U11.3 | U11.3 32.07,14.7 C1.1 | C4.1 31.9,16.7 U11.5 29.17,16.7 27.67,18.19 v23.37,18.19 | C60.2 22.31,29.24 v22.31,28.88 21.57,28.88 v21.5,28.95 | R8.1 6.72,12.34 v7.48,12.34 | 20.49,29.61 v20.49,28.97 | v21.5,28.95 20.51,28.95 v20.49,28.97
  Bottom 0.254: 20.16,29.3 v20.49,28.97 | v24.88,30.92 26.78,29.02 28.56,29.02 29.83,30.29 29.83,34.12 28.2,35.75 v28.18,35.73 | v16.14,48.43 16.14,35.31 v16.07,35.24
  Bottom 0.508: v21.5,28.95 21.45,28.9 21.45,18.32 v25,14.76 | v22.31,28.88 22.21,28.77 22.21,19.35 v23.37,18.19 | v7.48,12.34 7.48,12.47 8.24,13.23 16.8,13.23 20.74,17.18 20.74,28.72 v20.49,28.97 20.34,28.82
  pour Top (no thermals): 20.69,31.56 28.31,31.56 28.31,30.29 23.99,30.29 23.73,30.04 23.73,29.66 22.58,28.51 19.29,28.51 19.29,26.86 17.51,26.86 17.51,28.89 17.38,29.02 17.38,29.91 17.64,30.16 20.3,30.16 20.56,30.42 20.56,31.43
  pour Bottom: 18.91,29.78 23.48,29.78 23.48,27.37 19.04,27.37 18.91,27.5
  pour Top (no thermals): 15.43,32.14 16.7,32.14 16.88,31.97 16.95,31.89 16.95,30.47 17.1,30.32 17.61,30.32 17.61,28.97 17.46,28.82 15.76,28.82 15.43,29.15 15.17,29.4 15.17,30.24 15.17,32.07 15.23,32.12 15.25,32.14
BUZZER  (via drill 0.35)
  Top 0.254: R7.2 15.81,52.12 15.81,51.3 v15.86,51.3 | v16.19,33.52 16.19,34.18 15.38,34.99 v15.38,35.95 | v16.01,24.8 16.82,25.62 20.55,25.62 21.94,27.01 U11.23
  Bottom 0.254: v15.86,51.3 15.48,50.91 15.48,36.06 v15.38,35.95 | v16.19,33.52 16.01,33.34 v16.01,24.8
CUT1
  cutout Top: 33.51,45.02 33.89,45.02 33.89,38.67 33.51,38.67
  cutout Top: 28.31,33.47 28.56,33.47 28.56,30.42 28.31,30.42
  cutout Top: 26.02,45.02 26.02,45.4 33.89,45.4 33.89,45.02
  cutout Top: 28.69,38.29 28.69,38.67 33.89,38.67 33.89,38.29
  cutout Top: 25.13,32.58 25.38,32.58 25.38,31.56 25.13,31.56
DCDC_MODE  (via drill 0.35)
  Top 0.2: U$1.2 R25.2 30.6,35.1 v30.8,35.3 | U11.48 12.94,13.19 v13.85,14.1
  Bottom 0.2: v13.85,14.1 13.85,15.84 15.7,17.69 15.7,22.95 16.7,23.95 16.7,33.13 16.82,33.26 16.82,34.27 18.94,36.39 29.71,36.39 v30.8,35.3
GND  (via drill 0.35)  (7 unrouted)
  Top 0.254: 24.11,42.61 23.87,42.37 U1.5 22.46,41.34 22.08,40.96 20.83,40.96 R13.1 20.32,40.69 | C58.1 C57.1 24.54,33.84 U$1.6 25.91,34.45 26.02,34.34 26.15,34.47 U$1.TP | C59.1 C60.1 | v12.8,23.36 12.07,22.62 11.62,22.62 U11.37 U11.73 | U14.P$6 U14.P$7 6.2,16.41 7.28,15.33 | 7.28,15.33 S2.2 | R6.1 2.66,18.16 C5.2 3.82,15.64 S2.1 4.12,15.33 7.28,15.33 | U1.EPAD2 23.61,40.14 C44.2 | U1.10 24.25,44.37 24.11,44.51 | C9.1 23.21,49.34 24.37,49.34 | 24.37,49.34 26.15,49.34 | R11.1 24.48,49.23 24.37,49.34 | USB.5 6.33,54.43 | 24.53,16.61 25.44,15.7 U11.4 33.51,15.7 33.63,15.81 | 24.53,16.61 U11.65 U11.68 | U11.68 U11.71 17.44,18.92 17.51,18.99 | 17.51,18.99 17.89,19.37 17.57,19.7 U11.72 | U11.73 17.44,19.88 | 17.44,19.88 17.44,19.06 17.51,18.99 | U11.73 U11.70 | U11.70 U11.69 U11.68 | U11.70 U11.67 | 24.46,22.67 U11.67 | U11.66 U11.67 | U11.15 29.54,26.7 | C4.2 33.63,15.81 | 33.63,15.81 C1.2 33.63,13.26 33.06,12.7 U11.1 | U11.59 23.94,16.02 24.53,16.61 | 17.44,19.88 16.62,20.7 U11.39 | Q4.2 12.7,30.56 R5.1 | 5.59,34.23 5.59,35.06 v6.72,36.18 | 5.59,34.23 S1.2 | S1.1 5.47,34.11 5.59,34.23 | C12.1 6.9,34.15 R27.2 5.62,34.2 5.59,34.23
  Top 0.381: C7.2 8.14,19.8 8.14,21.31 v8.09,21.36
  Top 0.508: C11.1 C9.1 | C10.1 23.34,48.2 R9.1 | C11.1 R11.1 24.11,46.3 U1.EPAD5 24.11,44.51 24.11,42.61 U1.EPAD3 | U1.EPAD1 23.61,43.62 23.61,46.15 C11.1 | U$2.5 10.14,45.69 R14.1 | C8.1 7.49,43.26 7.59,43.16 | 26.15,49.34 26.91,49.34
  Top 0.762: C2.2 C3.2 19.42,31.13 19.42,32.58 | U11.59 23.78,11.68 v23.78,10.51 24.5,10.51 | v29.78,10.51 29.96,10.69 29.96,12.31 U11.1 | v33.78,10.51 31.32,10.51 | v11.78,10.51 11.78,11.26 11.67,11.37 10.91,10.61 10.91,10.51
  Top 1: 31.5,12 34,12 32.51,10.51 31.32,10.51 24.5,10.51 v11.78,10.51 10.91,10.51 7.49,10.51
  Top 1.016: R17.2 7.38,35.52 v6.72,36.18 | 6.46,40.12 6.46,42.91 v6.34,43.04 6.46,43.16 7.59,43.16 R15.1
  Bottom 0.762: U$4.5 35.14,33.47 34.63,33.97
  Bottom 1: 9,11 9.49,10.51 | 32.51,10.51 33,11 | v29.78,10.51 28.49,10.51 28,11 | v23.78,10.51 24,10.51
  Bottom 1.016: v6.72,36.18 6.34,36.56 v6.34,43.04
  Bottom 1.2: 24,10.51 v29.78,10.51 32.51,10.51 | v23.78,10.51 9.49,10.51
  other vias: 29.07,33.72 29.07,32.7 29.07,31.81 29.07,30.8 28.05,29.78 27.04,29.78 25.92,28.74 25.28,29.55 34.27,44.13 34.27,42.99 34.27,41.85 34.27,40.7 34.27,39.18 28.81,37.78 30.08,37.78 31.35,37.78 32.62,37.78 33.77,37.78 27.67,46.04 28.94,46.04 30.34,46.04 31.86,46.04 33.01,46.04 34.02,46.04 23.73,33.08 22.84,33.08 21.96,33.08 20.81,33.08 20.05,33.85 20.05,32.07 19.06,33.8 19.19,32.47 18.22,33.16 12.74,34.46 19.04,20.92 18.91,26.35 17.92,26.35 19.82,26.33 18.15,18.1 18.15,21.15 27.54,21.91 27.54,20.38 27.54,19.24 27.54,17.08 27.67,13.91 24.88,13.53 25.64,16.95 25.64,19.24 25.64,20.38 25.64,22.04 27.67,26.1 26.63,26.28 24.93,26.05 23.86,43.37 23.86,44.64 23.99,49.47 24.88,49.47 25.89,49.47 27.04,49.47 22.97,41.72 21.83,41.72 21.83,40.58 21.83,39.56 20.81,39.56 19.29,39.56 19.29,42.61 19.29,41.21 19.14,38.44 20.28,38.44 21.8,38.44 17.77,40.12 17.82,41.29 17.82,43.57 17.26,46.67 17.26,48.96 18.53,48.96 20.18,48.96 20.18,47.82 20.18,46.8 18.53,46.67 5.22,43.96 7.99,44.51 1.92,53.96 4.81,40.26 4.86,37.68 1.84,55.46 1.74,56.66 1.74,58.05 28.31,48.96 33.01,47.05 32.09,48.17 29.68,47.13 30.85,47.84 33.64,52.26 34.78,51.75 35.42,50.99 8.04,20.44 5.7,15.56 8.37,15.94 8.88,12.38 10.14,12.38 1.51,20.51 1.51,18.23 1.51,16.57 1.51,14.92 1.51,13.14 2.78,12.51 20.43,13.65 21.7,13.65 23.1,13.65 14.84,15.94 22.08,15.68 23.12,26.35 23.58,25.67 28.69,21.02 28.69,19.11 32.62,20.64 32.62,19.24 32.62,18.1 34.91,17.34 34.91,15.43 34.91,13.14 34.91,18.61 34.91,20.26 31.53,30.9 30.74,31.94 28.05,37.02 10.27,56.71 7.73,56.83 5.45,56.33 2.27,52.39 26.15,35.37 26.15,34.48 5.7,18.99 12.71,20.69 23.73,48.45 23.73,47.31 5.78,10.51 7.78,10.51 9.78,10.51 13.78,10.51 15.78,10.51 17.78,10.51 19.78,10.51 21.78,10.51 25.78,10.51 27.78,10.51 31.78,10.51 34.78,11.51 3.78,10.51 1.78,11.51 24.75,33.08 12.18,44.26 6.45,44.4 5.17,42.33 5.19,41.18 6.34,42.05 6.34,41.16 5.17,45.23 16.44,56.86 19.11,56.86 22.29,56.99 24.7,56.73 27.24,56.86 28.89,56.73 31.3,56.99 33.97,56.35 35.24,54.32 19.11,44.03 4.87,50.85 7.55,40.48 8.06,36.67 6.07,35.02 10.86,32.73 19.37,24.73 18.99,21.94 16.64,21.1 16.54,18.34 13.82,20.71 13.78,17.74 10.22,15.58 12.89,14.31 15.17,14.31 17.21,14.82 1.46,27.01 1.46,25.74 1.59,45.3 1.59,43.52 1.59,40.22 1.59,37.55 1.59,35.27 4.89,35.52 10.38,17.77 31.68,28.41 29.78,29.17 33.34,36.28 32.7,35.01 28.42,34.37 31.8,36.42
  pour Top (rank 4, no thermals): 1,60 36,60 37,59 37,11 36,10 1,10 -1.27,12.27 -1.27,57.73
  pour Bottom (rank 4, no thermals): 1,60 36,60 37,59 37,11 36,10 1,10 -0.76,11.76 -0.76,58.24
I2C_SCL  (via drill 0.35)
  Top 0.254: 8.51,24.44 8.51,24.31 10.78,24.31 11.16,24.7 U11.35 v12.63,24.7 | 8.51,24.44 R20.1 | 5.83,24.07 5.83,20.54 5.7,20.41 U14.P$13 | 8.51,24.44 8.13,24.07 5.83,24.07 | 5.83,24.07 5.36,24.07 3.98,25.44 v3.44,25.44
  Bottom 0.254: J3.2 3.42,25.71 3.44,25.69 v3.44,25.44 | v3.44,25.44 | J2.2 11.76,25.98 12.63,25.11 v12.63,24.7
I2C_SDA  (via drill 0.35)
  Top 0.254: R19.1 8.51,23.63 | 8.51,23.63 6.72,23.63 6.36,23.27 6.36,22.03 v6.49,21.9 6.46,21.88 | v5.17,20.99 5.2,20.96 U14.P$14 | 8.51,23.63 8.7,23.82 11.41,23.82 U11.36 11.87,24.02 13.3,24.02 13.57,24.3 v13.57,24.65
  Bottom 0.254: v5.17,20.99 5.42,20.99 6.34,21.9 v6.49,21.9 6.49,22.74 4.42,24.8 J3.3 | v13.57,24.65 13.57,24.78 12.76,25.59 J2.3
INT_IMU  (via drill 0.35)
  Top 0.254: U14.P$4 3.81,18.2 v3.79,18.19 | U11.45 11.23,14.38 v5.57,14.38
  Bottom 0.254: v3.79,18.19 3.79,15.65 5.06,14.38 v5.57,14.38
LEFT  (via drill 0.35)
  Top 0.254: U11.41 10.64,18.7 10.58,18.76 10.4,18.76 v10.37,18.73 | U$3.C U$3.D 28.13,52.79 28.13,52.57 27.52,51.96 21.27,51.96 18.98,49.67 v13.5,49.67 12.78,49.67 R22.2 | v9.15,49.47 9.15,49.16 9.05,49.05 6.73,49.05 2.91,45.23 v2.91,42.41
  Bottom 0.254: v10.37,18.73 8.76,20.35 8.76,23.04 6.14,25.66 6.14,27.14 5.63,27.65 4.5,27.65 2.91,29.24 v2.91,42.41 | v9.15,49.47 9.23,49.54 13.37,49.54 v13.5,49.67
MID  (via drill 0.35)
  Top 0.254: 26.9,53.12 U$3.E 26.9,53.52 26.2,54.22 23.2,54.22 22.57,53.58 21.6,53.58 18.63,50.61 14.7,50.61 v13.57,51.74 13.18,52.13 R21.2 | v4.26,42.28 4.26,45.41 6.96,48.11 9.55,48.11 10.3,48.86 10.3,50.71 v10.5,50.91 | U11.30 14.94,26.81 14.28,26.15 14.28,23.88 v13.85,23.46
  Bottom 0.254: v4.26,42.28 4.33,42.28 4.35,42.25 4.35,41.14 4,40.78 4,29.45 4.85,28.6 5.75,28.6 6.9,27.45 6.9,26.22 9.61,23.51 9.61,22.24 10.2,21.65 12.85,21.65 13.85,22.66 v13.85,23.46 | v10.5,50.91 12.53,50.91 13.37,51.75 v13.57,51.75 v13.57,51.74
N$1
  Top 0.254: U14.P$1 2.62,19.7 R6.2
N$2  (via drill 0.35)
  Top 0.254: U1.8 25.89,43.37 26.61,42.66 v26.68,42.66 | v26.66,48.07 26.53,48.2 R9.2
  Bottom 0.254: v26.68,42.66 26.68,48.05 v26.66,48.07
N$3  (via drill 0.35)
  Top 0.254: U1.7 25.76,42.87 26.02,42.61 26.02,41.97 v26.53,41.47 | v22.84,38.55 23.1,38.29 23.23,38.29 23.23,38.28 R10.1
  Bottom 0.254: v26.53,41.47 26.53,39.56 25.51,38.55 v22.84,38.55
N$4
  Top 0.508: U$2.4 11.09,45.37 R14.2
N$5
  Top 0.254: U1.3 20.7,43.37 R12.1 R13.2
N$6
  Top 0.254: Q4.3 11.75,32.84 12.28,32.3 13.29,32.3 Q3.1 14.07,30.54 R4.1
N$7
  Top 0.254: R15.2 8.54,41.88 U$2.1
N$8
  Top 1.016: Q1.1 11.3,36.66 R16.1 R17.1
N$9
  Top 0.254: SPK1.- 18.46,52.97 Q2.3
  Top 0.508: SPK1.-
N$10
  Top 0.254: Q4.1 10.8,30.51 R5.2 9.82,30.24 R24.1
N$11  (via drill 0.35)
  Top 0.254: R23.2 15.62,37.23 17.54,35.32 17.54,33.72 17.49,33.67 17.49,33.71 v17.53,33.76 | U11.12 30.26,23.62 18.76,23.62 v18.63,23.49
  Bottom 0.254: v17.53,33.76 17.53,33.56 17.26,33.29 17.26,24.86 v18.63,23.49
N$12  (via drill 0.35)
  Top 0.254: U11.54 18.94,12.76 18.8,12.9 v18.8,13
  Bottom 0.254: v18.8,13 17.85,12.05 TP1.TP
N$17
  Top 0.152: RGB2.RED 2.03,29.9 2.03,29.77 2.35,29.45 2.5,29.3 3.52,29.3 3.74,29.53 3.74,30.14 4.07,30.47 R1.1
N$18
  Top 0.254: R2.1 3.73,27.42 2.63,27.42 1.87,28.17 RGB2.GREEN
N$19
  Top 0.254: RGB2.BLUE 3.48,28.55 4.26,29.33 R3.1
N$21
  Top 0.254: Q2.1 16.73,53.54 R7.1
N$52
  Top 0.254: U$1.1 27.15,33.26 L2.1
  pour Top (no thermals): 26.91,34.61 27.42,34.61 28.18,33.85 28.18,32.58 25.38,32.58 25.38,33.59 25.51,33.72 26.53,33.72 26.78,33.97 26.78,34.61
PERI_EN  (via drill 0.35)
  Top 0.254: U1.1 22.46,45.22 22.49,45.25 v22.58,45.16 | v25.64,45.78 25.78,45.93 R11.2 | v12.86,15.63 11.6,15.63 U11.44 | v9.82,33.06 9.54,32.78 R24.2
  Bottom 0.254: v25.64,45.78 23.2,45.78 v22.58,45.16 17.7,45.16 16.77,44.23 16.77,34.84 16.24,34.3 15.99,34.3 15.43,33.74 15.4,33.74 | 15.4,33.74 15.4,32.55 14.11,31.26 14.11,29.12 15.25,27.97 15.25,18.02 v12.86,15.63 | 15.4,33.74 10.5,33.74 v9.82,33.06
RGB_B
  Top 0.254: R3.2 5.77,29.33 6.46,28.63 13.33,28.63 13.95,28.01 13.95,27.56 U11.31
RGB_G
  Top 0.254: U11.32 12.94,27.82 12.58,28.18 5.94,28.18 5.87,28.11 R2.2
RGB_R
  Top 0.254: U11.29 15.94,28.05 15.73,28.05 14.72,29.06 7.18,29.06 5.77,30.47 R1.2
RIGHT  (via drill 0.35)
  Top 0.254: U11.40 10.76,19.7 10.42,20.03 v10.42,20.04 | U$3.F U$3.G 23.81,52.97 21.65,52.97 18.83,50.15 14.16,50.15 13.45,50.86 R18.2 13.42,50.86 v13.45,50.84 | v3.59,41.64 3.59,45.32 6.83,48.57 9.3,48.57 9.82,49.08 9.82,50.05 v9.57,50.3
  Bottom 0.254: v10.42,20.04 9.2,21.27 9.2,23.36 6.52,26.03 6.52,27.32 5.69,28.14 4.71,28.14 3.44,29.41 3.44,41.64 v3.59,41.64 | v9.57,50.3 9.69,50.17 11.26,50.17 12.76,50.17 13.45,50.86 v13.45,50.84
SENSOR_RST  (via drill 0.35)
  Top 0.254: U11.55 19.94,12.9 19.77,13.07 v19.75,13.05
  Bottom 0.254: v19.75,13.05 20.54,12.26 27.26,12.26 28.53,13.54 28.53,14.54 28.98,14.99 28.98,18.34 30.31,19.67 30.31,23.74 32.78,26.2 32.78,29.63 34.39,31.24 U$4.4
SENSOR_RXD  (via drill 0.35)
  Top 0.254: U11.63 27.94,13.13 28.94,14.13 v29.2,14.13
  Bottom 0.254: U$4.3 34.31,30.24 33.18,29.11 33.18,26 30.77,23.59 30.77,19.37 29.47,18.07 29.47,14.41 v29.2,14.13
SENSOR_TXD  (via drill 0.35)
  Top 0.254: v28.99,13.06 28.99,11.9 U11.64
  Bottom 0.254: v28.99,13.06 29.17,13.06 29.88,13.78 29.88,17.62 31.2,18.93 31.2,23.41 33.62,25.82 33.62,28.54 34.32,29.24 U$4.2
USB  (via drill 0.35)
  Top 0.254: v12.96,36.33 12.96,36.06 12.6,35.7 R16.2 12.6,35.25 12.1,34.75 10.95,34.75 R26.1
  Top 0.381: USB.1 8.93,54.41
  Top 0.4: 8.93,54.41 8.93,54.32 9.36,53.9 9.36,52.1
  Top 0.5: D3.A 13.6,44.82 v13.12,44.33
  Top 0.6: C8.2 9.2,45.5 U$2.6
  Top 0.8: v11.67,47.08 12.57,47.08 13.4,46.26 | D3.A 13.41,46.25 12.55,47.1
  Top 1: C8.2 8.99,46.89 9.2,47.1 12.55,47.1 13.4,46.26
  Bottom 0.254: v13.12,44.33 13.12,36.48 v12.96,36.33 | v9.72,51.98 9.72,51.96
  Bottom 0.6: 11.2,47.1 10.2,47.1 | 10.2,47.1 10.1,47.1 | 8.1,49.2 10.05,47.25 10.2,47.1 | 8.1,49.1 8.2,49 | v10.77,47.08 v11.67,47.08
  Bottom 0.8: v11.67,47.08 10.22,47.08 10.05,47.25 | 10.1,47.1 8.2,49 | 8.1,49.1 8.1,49.2 8.1,51.3 8.76,51.96 9.72,51.96
  other vias: 8.92,51.98
  pour Top (no thermals): 8.42,52.46 10.19,52.46 10.2,52.47 10.2,51.5 8.42,51.5
USB_DET  (via drill 0.35)
  Top 0.254: U11.43 10.05,16.7 9.55,17.2 9.55,22.24 v10.41,23.1 | R26.2 9.1,34.2 R27.1 8.4,34.05 C12.2 8.05,33.05 v8.05,33.35
  Bottom 0.254: v8.05,33.35 7.95,33.35 6.65,33.35 5.3,32 5.3,29.6 7.35,27.55 7.35,26.4 10.41,23.34 v10.41,23.1
USB_N  (via drill 0.35)
  Top 0.152: U11.62 26.94,13.04 arc45 v26.91,13.11 | USB.2 8.28,53.96 arc-90 v8.2,53.87
  Bottom 0.152: v26.91,13.11 arc-45 26.66,13.73 26.66,21.57 arc-45 27.4,23.36 28.39,24.35 arc45 29.22,26.36 29.22,26.38 arc-45 29.74,27.64 33.04,30.94 arc45 33.87,32.93 33.87,33.95 arc-45 34.52,35.51 35.06,36.05 arc45 35.55,37.23 35.55,48.16 arc45 34.71,50.17 32.82,52.06 arc45 30.81,52.9 9.17,52.9 arc-90 v8.2,53.87
USB_P  (via drill 0.35)
  Top 0.152: U11.61 25.94,12.97 arc-45 v26,13.11 | USB.3 arc90 7.5,55.06 7.5,53.17 arc90 v7.67,53
  Bottom 0.152: v26,13.11 26.06,13.17 arc45 26.35,13.88 26.35,21.57 arc-45 27.18,23.58 28.17,24.57 arc45 28.92,26.36 28.92,26.38 arc-45 29.53,27.85 32.83,31.15 arc45 33.56,32.93 33.56,33.95 arc-45 34.3,35.73 34.84,36.27 arc45 35.24,37.23 35.24,48.16 arc45 34.5,49.96 32.61,51.85 arc45 30.81,52.59 8.74,52.59 arc-45 7.76,53 v7.67,53
VBAT  (via drill 0.35)
  Top 0.254: 9.22,38.81 9.38,38.97 | Q1.3 9.45,37.96 13,37.96 R23.1
  Top 0.762: U$2.2 10.14,39.74 9.38,38.97 v9.38,38.82 Q1.3
  Bottom 0.762: J4.2 8.94,38.59 8.93,38.57 9.12,38.57 v9.38,38.82
  other vias: 8.61,39.33 8.66,38.29
  pour Bottom (no thermals): 8.37,39.81 9.99,39.81 10.2,39.61 10.2,38.27 10.12,38.19 9.71,37.78 8.44,37.78 8.27,37.96 8.27,38.16 8.27,39.71
  pour Top (no thermals): 8.44,39.81 10.02,39.81 10.2,39.64 10.2,38.19 10.2,37.61 9.97,37.38 9.94,37.35 8.6,37.35 8.42,37.35 8.29,37.48 8.27,37.5 8.27,39.66 8.42,39.81
VCC_PERI  (via drill 0.35)
  Top 0.254: U14.P$8 C7.1 8.09,18.05 v8.09,16.98 | v5.27,16.8 v5.26,16.8 C5.1 5.2,17.83 U14.P$5 | v6.89,20.89 6.2,20.2 U14.P$12
  Top 0.381: v14.16,32.93 14.98,33.73 Q3.3 14.63,33.34 14.03,33.34 14.03,34.33 v13.83,34.53 | v7.4,21.98 7.4,22.7 R19.2 | R20.2 7.19,24.82 5.74,24.82 v5.59,24.97 7.38,26.76 9.51,26.76 9.74,26.99 v9.87,26.99 | C7.1 8.24,17.13 v8.09,16.98 | v14.92,51.32 14.59,51.65 14.59,54.01 13.63,54.98 SPK1.+
  Bottom 0.254: v5.27,16.8 7.91,16.8 v8.09,16.98 7.99,16.98 7.38,17.59 7.38,20.41 v6.89,20.89
  Bottom 0.381: v8.09,16.98 11.67,16.98 14.61,19.93 14.61,27.6 13.32,28.89 13.32,32.05 v14.16,32.93 | 7.3,22.09 v7.4,21.98 7.4,23.23 5.66,24.97 | J2.4 13.76,27.05 12.81,28 12.81,32.22 13.5,32.91 14.06,32.91 v14.16,32.93 | 5.66,24.97 5.42,25.2 J3.4 | 5.66,24.97 v5.59,24.97 | v9.87,26.99 9.87,27.37 10.86,28.36 11.95,28.36 12.25,28.66 12.25,32.3 12.94,32.98 13.98,32.98 v14.16,32.93 | v14.92,51.32 14.89,51.3 14.89,37.57 14.62,37.3 14.62,35.32 v13.83,34.53
  other vias: 13.24,32.98
  pour Bottom (no thermals): 12.23,33.41 14.69,33.41 14.69,31.99 12.2,31.99 12.08,32.12 12.08,33.26
  pour Top (no thermals): 13.37,34.89 14.82,34.89 15.53,34.18 15.53,32.86 15.07,32.4 12.99,32.4 12.79,32.6 12.79,33.62 13.37,34.2
VSYS
  Top 0.254: U1.6 25.26,39.95 25.03,39.72 | U$1.5 U$1.4
  Top 0.508: C44.1 24.94,37.59 24.88,37.53 24.77,37.64 R10.2
  Top 0.762: R10.2 24.77,37.42 23.99,36.64 19.59,36.64 16.56,39.67 15.03,39.67 12.36,39.67
  Top 1: 15.03,39.67 19.2,35.5 23.7,35.5 C57.2 C58.2 C56.2 | D3.C 13.6,40.91 13.32,40.62
  Top 1.016: Q1.2 11.53,38.83 12.36,39.67 | 13.32,40.62 12.36,39.67 | 12.88,39.67 12.36,39.67 | L4.P$1 25.03,39.72 C44.1
  pour Top (no thermals): 23.73,35.95 25.44,35.95 25.51,35.88 25.51,34.99 25.38,34.86 24.37,34.86 24.24,34.73 23.73,34.73
  pour Top (no thermals): 24.88,42.48 25.64,42.48 25.77,42.35 25.77,41.09 26.02,40.83 28.94,40.83 28.94,38.8 26.91,36.77 24.24,36.77 24.24,40.7 24.88,41.34
  pour Top (no thermals): 12.76,40.86 15.89,40.86 16.79,39.95 16.32,39.48 13.29,39.48 12.2,38.39 10.91,38.39 10.91,39.71 11.54,40.35 12.25,40.35

### Text on the board
tPlace: JLCJLCJLCJLC